# EAGLE design xpower_A (EAGLE 7.7.0)
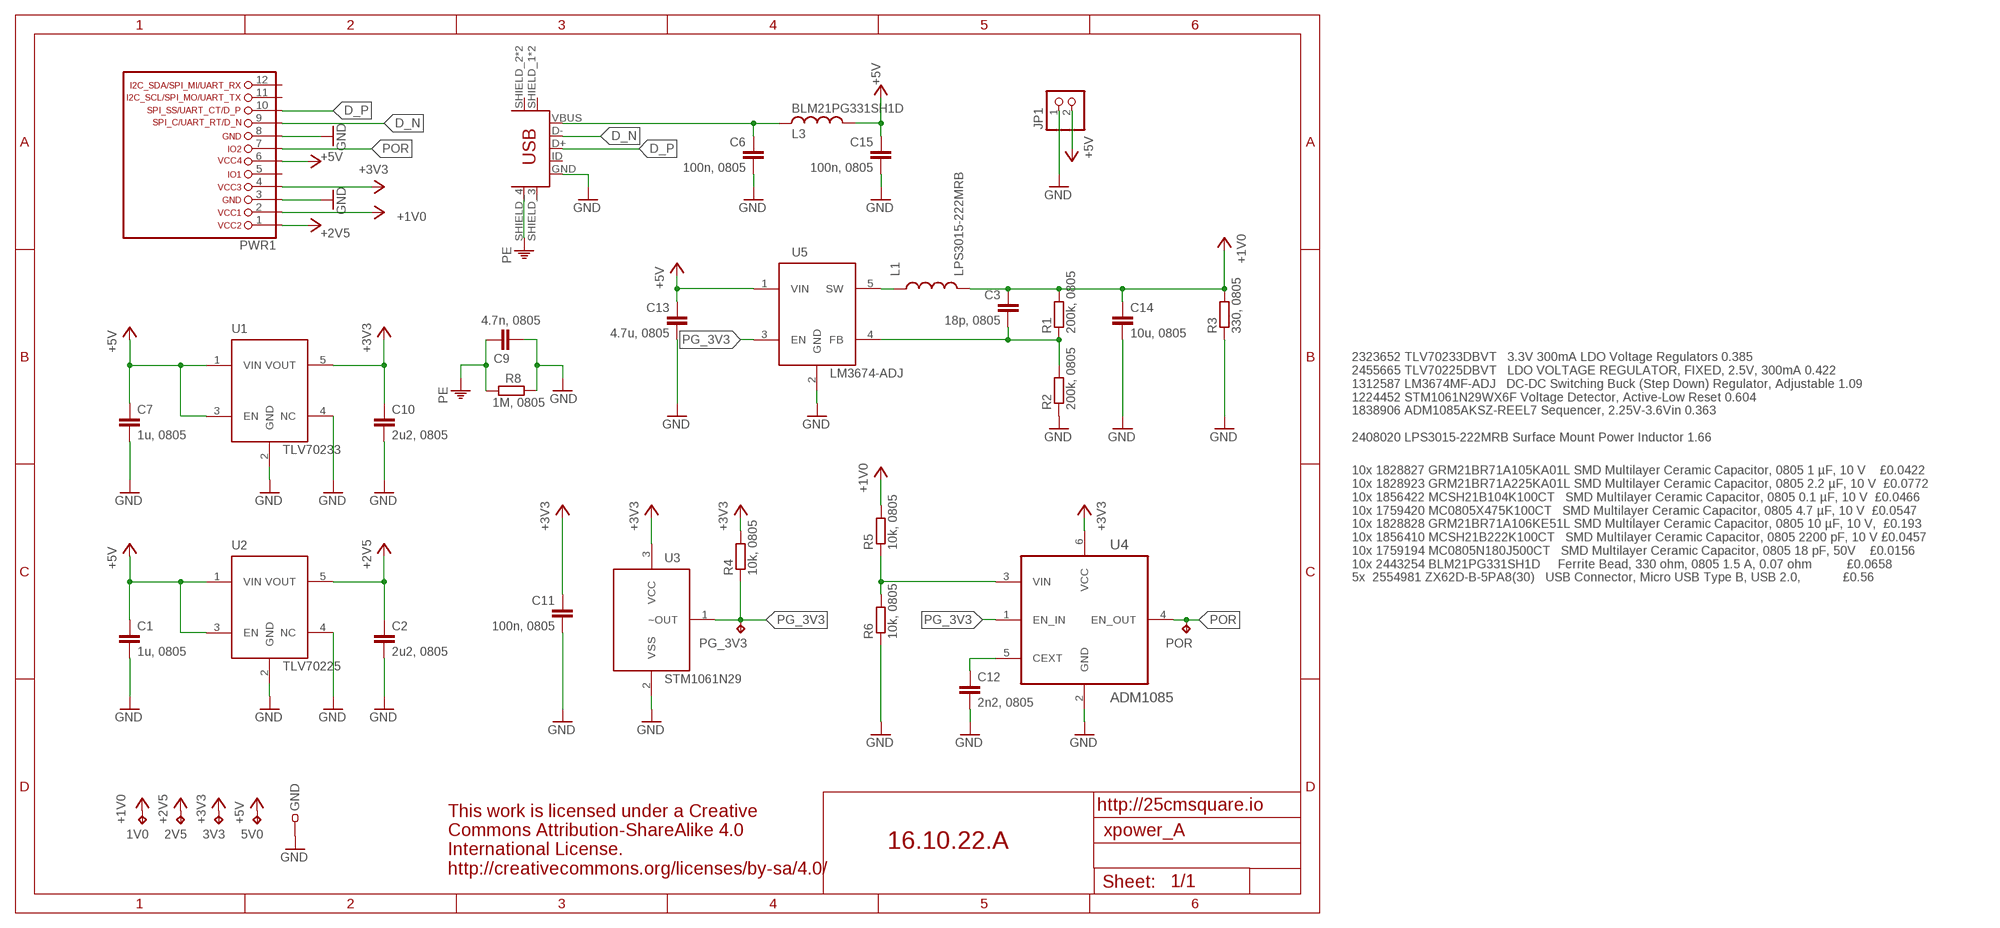
[diagram p0: schematic, sheet 1]

## Parts
1V0  TPTP14R  [TP14R]
2V5  TPTP14R  [TP14R]
3V3  TPTP14R  [TP14R]
5V0  TPTP14R  [TP14R]
C1  1u, 0805  C-EUC0805  [C0805]
C2  2u2, 0805  C-EUC0805  [C0805]
C3  18p, 0805  C-EUC0805  [C0805]
C6  100n, 0805  C-EUC0805  [C0805]
C7  1u, 0805  C-EUC0805  [C0805]
C9  4.7n, 0805  C-EUC0805  [C0805]
C10  2u2, 0805  C-EUC0805  [C0805]
C11  100n, 0805  C-EUC0805  [C0805]
C12  2n2, 0805  C-EUC0805  [C0805]
C13  4.7u, 0805  C-EUC0805  [C0805]
C14  10u, 0805  C-EUC0805  [C0805]
C15  100n, 0805  C-EUC0805  [C0805]
GND  TEST-22-MULTICOMP  [TEST_1MM]
JP1  PINHD-1X2  [1X02]
L1  LPS3015-222MRB  LPS3015  [LPS3015]
L3  BLM21PG331SH1D  L-USL0805  [R0805]
PG_3V3  TPTP14R  [TP14R]
POR  TPTP14R  [TP14R]
PWR1  LIWE_12_PIN_PWR5X5  [LIWE_12_PIN]
R1  200k, 0805  R-EU_R0805  [R0805]
R2  200k, 0805  R-EU_R0805  [R0805]
R3  330, 0805  R-EU_R0805  [R0805]
R4  10k, 0805  R-EU_R0805  [R0805]
R5  10k, 0805  R-EU_R0805  [R0805]
R6  10k, 0805  R-EU_R0805  [R0805]
R8  1M, 0805  R-EU_R0805  [R0805]
U1  TLV70233  TLV702  [SOT-23-5]
U2  TLV70225  TLV702  [SOT-23-5]
U3  STM1061N29  STM1061  [SOT-23-3]
U4  ADM1085  [SOT65P210X110-6N]
U5  LM3674-ADJ  [SOT-23-5]
U$5  ZX62D-B-5PA8  [ZX62D-B-5PA8]

## Nets
+1V0: 1V0.TP C3.1 C14.1 L1.P2 PWR1.2 R1.2 R3.2 R5.2
+2V5: 2V5.TP C2.1 PWR1.1 U2.5(VOUT)
+3V3: 3V3.TP C10.1 C11.1 PWR1.4 R4.2 U1.5(VOUT) U3.3(VCC) U4.6(VCC)
+5V: 5V0.TP C1.1 C7.1 C13.1 C15.1 JP1.2 L3.1 PWR1.6 U1.1(VIN) U1.3(EN) U2.1(VIN) U2.3(EN) U5.1(VIN)
CEXT: C12.1 U4.5(CEXT)
D_N: PWR1.9 U$5.D-
D_P: PWR1.10 U$5.D+
FB: C3.2 R1.1 R2.2 U5.4(FB)
GND: C1.2 C2.2 C6.2 C7.2 C9.2 C10.2 C11.2 C12.2 C13.2 C14.2 C15.2 GND.1 JP1.1 PWR1.3 PWR1.8 R2.1 R3.1 R6.1 R8.1 U1.2(GND) U1.4(NC) U2.2(GND) U2.4(NC) U3.2(VSS) U4.2(GND) U5.2(GND) U$5.GND
L: L1.P1 U5.5(SW)
PE: C9.1 R8.2 U$5.SHIELD_4(MTN4)
PG_3V3: PG_3V3.TP R4.1 U3.1(~OUT) U4.1(EN_IN) U5.3(EN)
POR: POR.TP PWR1.7 U4.4(EN_OUT)
VBUS: C6.1 L3.2 U$5.VBUS
VIN: R5.1 R6.2 U4.3(VIN)
Unconnected: PWR1.5 PWR1.11 PWR1.12 U$5.ID U$5.SHIELD_1(MTN1) U$5.SHIELD_2(MTN2) U$5.SHIELD_3(MTN3) U$5.SHIELD_A(MTN1) U$5.SHIELD_B(MTN2)

## Notes on the sheet
- 2323652 TLV70233DBVT   3.3V 300mA LDO Voltage Regulators 0.385
  2455665 TLV70225DBVT   LDO VOLTAGE REGULATOR, FIXED, 2.5V, 300mA 0.422
  1312587 LM3674MF-ADJ   DC-DC Switching Buck (Step Down) Regulator, Adjustable 1.09
  1224452 STM1061N29WX6F Voltage Detector, Active-Low Reset 0.604
  1838906 ADM1085AKSZ-REEL7 Sequencer, 2.25V-3.6Vin 0.363
  
  2408020 LPS3015-222MRB Surface Mount Power Inductor 1.66
- 10x 1828827 GRM21BR71A105KA01L SMD Multilayer Ceramic Capacitor, 0805 1 µF, 10 V    £0.0422
  10x 1828923 GRM21BR71A225KA01L SMD Multilayer Ceramic Capacitor, 0805 2.2 µF, 10 V  £0.0772
  10x 1856422 MCSH21B104K100CT   SMD Multilayer Ceramic Capacitor, 0805 0.1 µF, 10 V  £0.0466
  10x 1759420 MC0805X475K100CT   SMD Multilayer Ceramic Capacitor, 0805 4.7 µF, 10 V  £0.0547
  10x 1828828 GRM21BR71A106KE51L SMD Multilayer Ceramic Capacitor, 0805 10 µF, 10 V,  £0.193
  10x 1856410 MCSH21B222K100CT   SMD Multilayer Ceramic Capacitor, 0805 2200 pF, 10 V £0.0457
  10x 1759194 MC0805N180J500CT   SMD Multilayer Ceramic Capacitor, 0805 18 pF, 50V    £0.0156
  10x 2443254 BLM21PG331SH1D     Ferrite Bead, 330 ohm, 0805 1.5 A, 0.07 ohm          £0.0658
  5x  2554981 ZX62D-B-5PA8(30)   USB Connector, Micro USB Type B, USB 2.0,            £0.56
- http://25cmsquare.io
- 16.10.22.A
- This work is licensed under a Creative
  Commons Attribution-ShareAlike 4.0
  International License.
  http://creativecommons.org/licenses/by-sa/4.0/

## Library data of the parts
1V0 2V5 3V3 5V0 PG_3V3 POR = testpad:TP: Test pad
C1-C3 C6 C7 C9-C15 = rcl:C-EU: CAPACITOR, European symbol
GND = 25cmsquare:TEST-22-MULTICOMP: MULTICOMP TEST-22 TEST PIN, PCB, 1.0MM FARNELL: 1702010
JP1 = pinhead:PINHD-1X2: PIN HEADER
L1 = inductor-coilcraft:LPS3015
L3 = resistor:L-US: INDUCTOR, American symbol
PWR1 = 25cmsquare:LIWE_12_PIN_PWR
R1-R6 R8 = rcl:R-EU_: RESISTOR, European symbol
U1 U2 = 25cmsquare:TLV702
U3 = 25cmsquare:STM1061
U4 = 25cmsquare:ADM1085: Simple Sequencers® in 6-Lead SC70; MPN: ADM1085AKSZ-REEL7; OC_FARNELL: 1838906; OC_NEWARK: 59K1876; PACKAGE: SOT-23-6; SUPPLIER: Analog Devices
U5 = 25cmsquare:LM3674-ADJ
U$5 = pma:ZX62D-B-5PA8

## Board
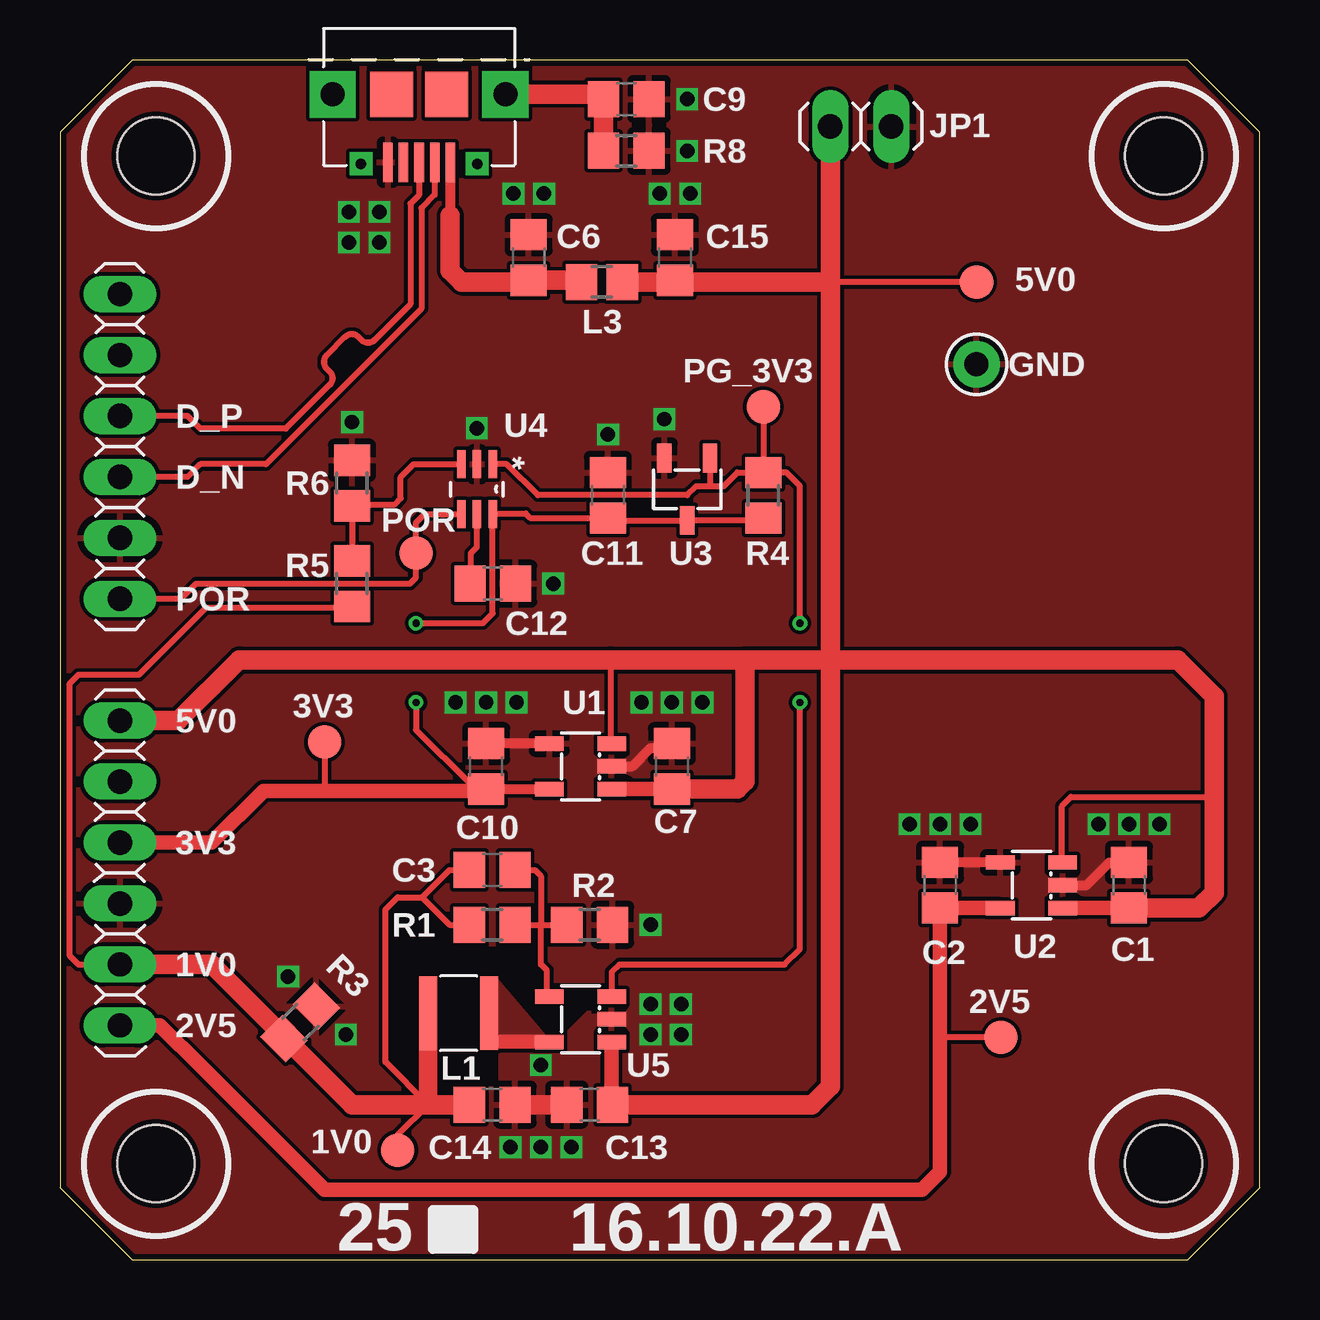
[diagram p1: board, top side]
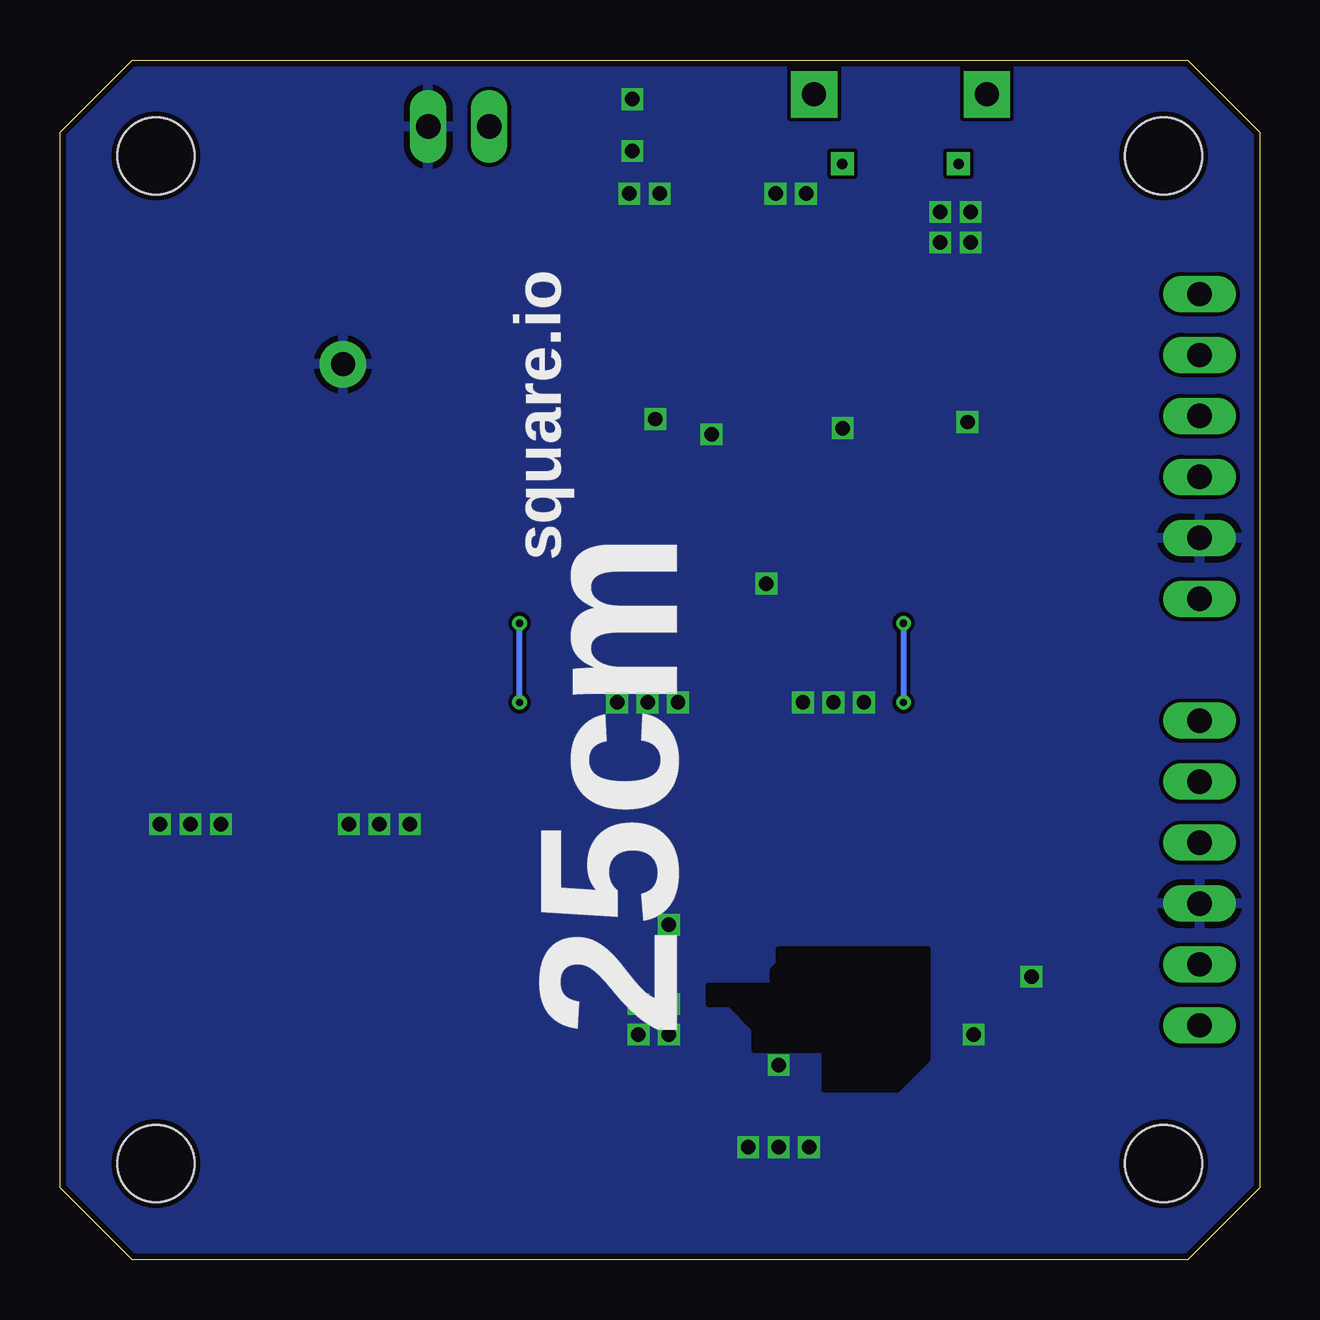
[diagram p2: board, bottom side, seen from below]

Size 50 x 50 mm. Coordinates in mm from the lower left corner, seen from the top.
Copper layers (1*16): Top 0.035mm / dielectric 1.5mm / Bottom 0.035mm
Design rules "SeeedStudio_2layer_DRU_no_angle_20140221": minimum track width 6mil, minimum drill 12mil, track to track 6mil, track to pad 6mil, pad to pad 6mil, via to via 6mil, smd to smd 0mil, copper to edge 10mil, drill to drill 10mil, minimum pad ring 10mil, minimum via ring 6mil, stop-mask expansion 2mil, vias tented up to drill 100mil, thermal gap 10mil
tRestrict: area 13.7,7.3 to 23,12.9
bRestrict: area 13.8,7.1 to 23,12.9

### Footprints (pad centres in the part's own frame; a part is rotated, then mirrored left to right if it is on the bottom)
TP14R = smd 1.4 x 1.4: TP 0,0
C0805 = smd 1.3 x 1.5: 1 -0.95,0; 2 0.95,0
TEST_1MM = drill 1 pad 1.93: 1 0,0
1X02 = drill 1.016 long: 1 -1.27,0; 2 1.27,0
LPS3015 = smd 0.762 x 3.048: P1 0.381,1.524; P2 2.921,1.524
R0805 = smd 1.3 x 1.5: 1 -0.85,0; 2 0.85,0
LIWE_12_PIN = drill 1.016 long: 1 22.5,15.24; 2 22.5,12.7; 3 22.5,10.16; 4 22.5,7.62; 5 22.5,5.08; 6 22.5,2.54; 7 22.5,-2.54; 8 22.5,-5.08; 9 22.5,-7.62; 10 22.5,-10.16; 11 22.5,-12.7; 12 22.5,-15.24 | hole 3.2: -21,-21; 21,-21; -21,21; 21,21
R0805' = smd 1.3 x 1.5: 1 -0.95,0; 2 0.95,0
SOT-23-5 = smd 0.6 x 1.2: 1 -0.95,-1.3; 2 0,-1.3; 3 0.95,-1.3; 4 0.95,1.3; 5 -0.95,1.3
SOT-23-3 = smd 0.6 x 1.2: 1 -0.95,-1.3; 2 0.95,-1.3; 3 0,1.3
SOT65P210X110-6N = smd 1.168 x 0.356: 1 -1.041,0.66; 2 -1.041,0; 3 -1.041,-0.66; 4 1.041,-0.66; 5 1.041,0; 6 1.041,0.66
ZX62D-B-5PA8 = smd 0.4 x 1.65 bottom: D+ 0,4.285; D- 0.65,4.285; GND -1.3,4.285; ID -0.65,4.285; VBUS 1.3,4.285 | drill 0.45 pad 0.813 square: SHIELD_1 -2.425,4.35; SHIELD_2 2.425,4.35 | drill 1 pad 1.93 square: SHIELD_3 -3.6,1.45; SHIELD_4 3.6,1.45 | smd 1.8 x 1.9 bottom: SHIELD_A -1.15,1.45; SHIELD_B 1.15,1.45

### Placement (x,y rotation side)
1V0  14.08,4.55 0 top
2V5  39.22,9.25 0 top
3V3  11.03,21.57 0 top
5V0  38.21,40.75 0 top
C1  44.56,15.6 90 top
C2  36.68,15.6 90 top
C3  18.02,16.24 0 top
C6  19.54,41.76 90 top
C7  25.51,20.56 90 top
C9  23.6,48.37 0 top
C10  17.76,20.56 90 top
C11  22.84,31.86 90 top
C12  18.04,28.18 0 top
C13  22.08,6.46 180 top
C14  18.02,6.46 0 top
C15  25.64,41.76 90 top
GND  38.21,37.32 0 top
JP1  33.38,47.23 180 top
L1  18.27,11.79 180 top
L3  22.59,40.75 180 top
PG_3V3  29.32,35.54 0 top
POR  14.84,29.45 0 top
PWR1  25,25 180 top
R1  200k, 0805  [R0805']  18.02,13.95 180 top
R2  200k, 0805  [R0805']  22.08,13.95 180 top
R3  330, 0805  [R0805']  10.01,9.89 225 top
R4  10k, 0805  [R0805']  29.32,31.86 270 top
R5  10k, 0805  [R0805']  12.17,28.18 270 top
R6  10k, 0805  [R0805']  12.17,32.37 270 top
R8  1M, 0805  [R0805']  23.6,46.21 180 top
U1  21.7,20.56 90 top
U2  40.49,15.6 90 top
U3  26.14,32.11 180 top
U4  17.38,32.11 270 top
U5  21.7,10.01 90 top
U$5  14.97,50.02 180 bottom

### Tracks (layer width: path | path; a pad name or v marks a point on that pad's centre or on a via)
+1V0
  Top 0.254: PWR1.2 0.77,12.3 0.39,12.68 0.39,23.98 0.77,24.37 3.28,24.37 6.08,27.16 12.11,27.16 arc90 R5.2 | 15.09,15.09 14.08,15.09 13.57,14.59 13.57,8.24 15.35,6.46 14.08,5.19 1V0.TP | 15.09,15.09 16.24,16.24 C3.1 | 15.09,15.09 16.24,13.95 R1.2
  Top 0.762: L1.P2 15.35,6.46
  Top 0.813: 9.51,9.13 12.17,6.46 15.35,6.46 C14.1 | 9.51,9.13 6.33,12.3 PWR1.2 | R3.2 9.43,9.13 9.51,9.13
+2V5
  Top 0.254: 2V5.TP 36.68,9.25
  Top 0.61: U2.5 C2.1 36.68,9.25 36.68,3.66 35.92,2.9 11.03,2.9 5.95,7.98 4.15,9.76 PWR1.1
+3V3  (via drill 0.3)
  Top 0.254: 17.7,19.67 C10.1 | v14.84,23.22 14.84,22.08 17.13,19.79 17.13,19.54 | v14.84,26.52 17.63,26.52 18.04,26.93 U4.6 18.07,31.1 19.41,31.1 19.6,30.91 C11.1 22.94,30.81 U3.3 29.22,30.81 R4.2 | 3V3.TP 11.03,19.54
  Top 0.406: U1.5 C10.1 17.76,19.16
  Top 0.61: 17.7,19.67 17.57,19.54 17.13,19.54 11.03,19.54 8.49,19.54 6.33,17.38 PWR1.4
  Bottom 0.254: v14.84,26.52 v14.84,23.22
+5V
  Top 0.254: 41.76,16.55 41.76,18.9 42.14,19.29 48.11,19.29 | U1.3 22.97,21.51 22.97,25 | C15.1 26.14,40.81 26.14,40.75 | 5V0.TP 32.11,40.75
  Top 0.406: U1.3 22.97,21.54 | U2.3 41.76,16.55
  Top 0.61: U1.1 C7.1 | C1.1 U2.1 | C13.1 23,6.49 U5.1
  Top 0.813: 32.11,40.75 32.11,40.49 32.11,25 | C1.1 47.48,14.65 48.11,15.29 48.11,19.29 48.11,23.48 46.59,25 32.11,25 | PWR1.6 4.93,22.46 7.47,25 22.97,25 28.56,25 | 32.11,25 32.11,7.22 31.35,6.46 C13.1 | 25.57,19.54 C7.1 28.24,19.61 28.56,19.92 28.56,25 | 32.11,25 28.56,25 | 32.11,40.75 26.14,40.75 | L3.1 25.57,40.75 C15.1 | JP1.2 32.11,40.75
CEXT
  Top 0.254: C12.1 17.13,27.98 17.13,29.45 17.38,29.7 U4.5
D_N
  Top 0.254: U$5.D- 15.62,44.38 15.07,43.83 15.07,39.64 8.59,33.15 5.85,33.15 5.32,32.62 PWR1.9
D_P
  Top 0.254: U$5.D+ 14.97,44.37 14.61,44.02 14.61,39.83 13.11,38.33 arc-90 12.57,38.33 12.43,38.46 arc90 11.9,38.46 11.11,37.68 arc90 11.11,37.14 11.25,37 arc-90 11.25,36.47 9.41,34.63 5.85,34.63 5.32,35.16 PWR1.10
FB
  Top 0.254: R1.1 20.05,13.95 | 20.05,13.95 R2.2 | U5.4 20.3,11.06 20.3,12.05 20.05,12.3 20.05,13.95 | C3.2 19.79,16.24 20.05,15.98 20.05,13.95
GND  (via drill 0.6)
  Top 0.406: U2.2 42.78,15.6 43.73,16.55 C1.2 | U1.2 23.86,20.56 24.62,21.32 25.32,21.32 | U1.4 C10.2 | U2.4 36.81,16.55
  Top 0.813: 25.32,21.32 C7.2 | 36.81,16.55 C2.2 | C14.2 C13.2
  other vias: 25.89,10.65 24.62,9.38 24.62,10.65 43.29,18.14 44.56,18.14 45.83,18.14 25.89,9.38 24.62,13.95 12.17,34.91 13.32,42.4 12.05,42.4 13.32,43.67 12.05,43.67 20.17,44.43 18.9,44.43 26.27,44.43 25,44.43 16.49,23.22 17.76,23.22 19.03,23.22 20.55,28.18 17.38,34.65 22.84,34.4 25.19,35.03 24.24,23.22 25.51,23.22 26.78,23.22 35.41,18.14 36.68,18.14 37.95,18.14 18.78,4.68 20.05,4.68 21.32,4.68 9.51,11.79 11.92,9.38 20.05,8.11 26.14,48.37 26.14,46.21
  pour Bottom: -15.77,59.29 64.75,59.8 64.88,-13.23 -15.64,-13.73
  pour Top (rank 6): -9.67,54.72 -9.67,-4.34 56.5,-4.34 56.5,54.72
  pour Top (no thermals): 22.08,10.14 23.6,10.14 23.86,10.52 24.11,10.4 24.11,9.63 23.86,9.51 23.6,9.89 22.33,9.89 21.95,9.25
  pour Top (no thermals): 40.75,16.24 41.26,15.73 42.4,15.73 42.78,16.24 42.65,15.22 42.27,15.48 41.26,15.48 40.75,14.97
  pour Top (no thermals): 21.95,21.19 22.46,20.68 23.48,20.68 23.98,21.06 23.98,20.17 23.48,20.43 22.46,20.43 21.95,19.92
L
  Top 0.406: 18.08,9.06 18.02,9 18.02,10.14 L1.P1
  Top 0.584: U5.5 18.08,9.06
  pour Top (no thermals): 18.14,11.67 20.17,9.25 20.81,9.25 20.81,9.13 17.89,9.13 17.89,11.67
PE
  Top 0.813: U$5.SHIELD_4 22.45,48.57 C9.1 R8.2
PG_3V3  (via drill 0.3)
  Top 0.254: v30.84,23.22 30.84,12.94 30.21,12.3 23.32,12.3 23,11.98 U5.3 | U3.1 27.09,33.32 27.1,33.31 27.1,32.24 | v30.84,26.52 30.84,32.24 30.27,32.81 R4.1 | PG_3V3.TP R4.1 | U4.1 18.62,33.15 19.92,31.86 26.14,31.86 26.52,32.24 27.1,32.24 | 27.1,32.24 27.67,32.24 28.24,32.81 R4.1
  Bottom 0.254: v30.84,23.22 v30.84,26.52
POR
  Top 0.254: U4.4 15.2,31.07 14.84,30.72 POR.TP 14.84,28.43 14.59,28.18 5.68,28.18 5.04,27.54 PWR1.7
VBUS
  Top 0.406: U$5.VBUS 16.27,43.51
  Top 0.813: 16.27,43.51 16.27,41.23 16.75,40.75 19.47,40.75 C6.1 21.67,40.81 L3.2
VIN
  Top 0.254: R5.1 R6.2 12.23,31.48 13.95,31.48 14.21,31.73 14.21,32.62 14.74,33.15 U4.3

### Text on the board
tNames: D_P | D_N | POR | 5V0 | 3V3 | 1V0 | 2V5 | 25 | 16.10.22.A
bNames: square.io | 25cm